# EAGLE design B135X (EAGLE 6.6.0)
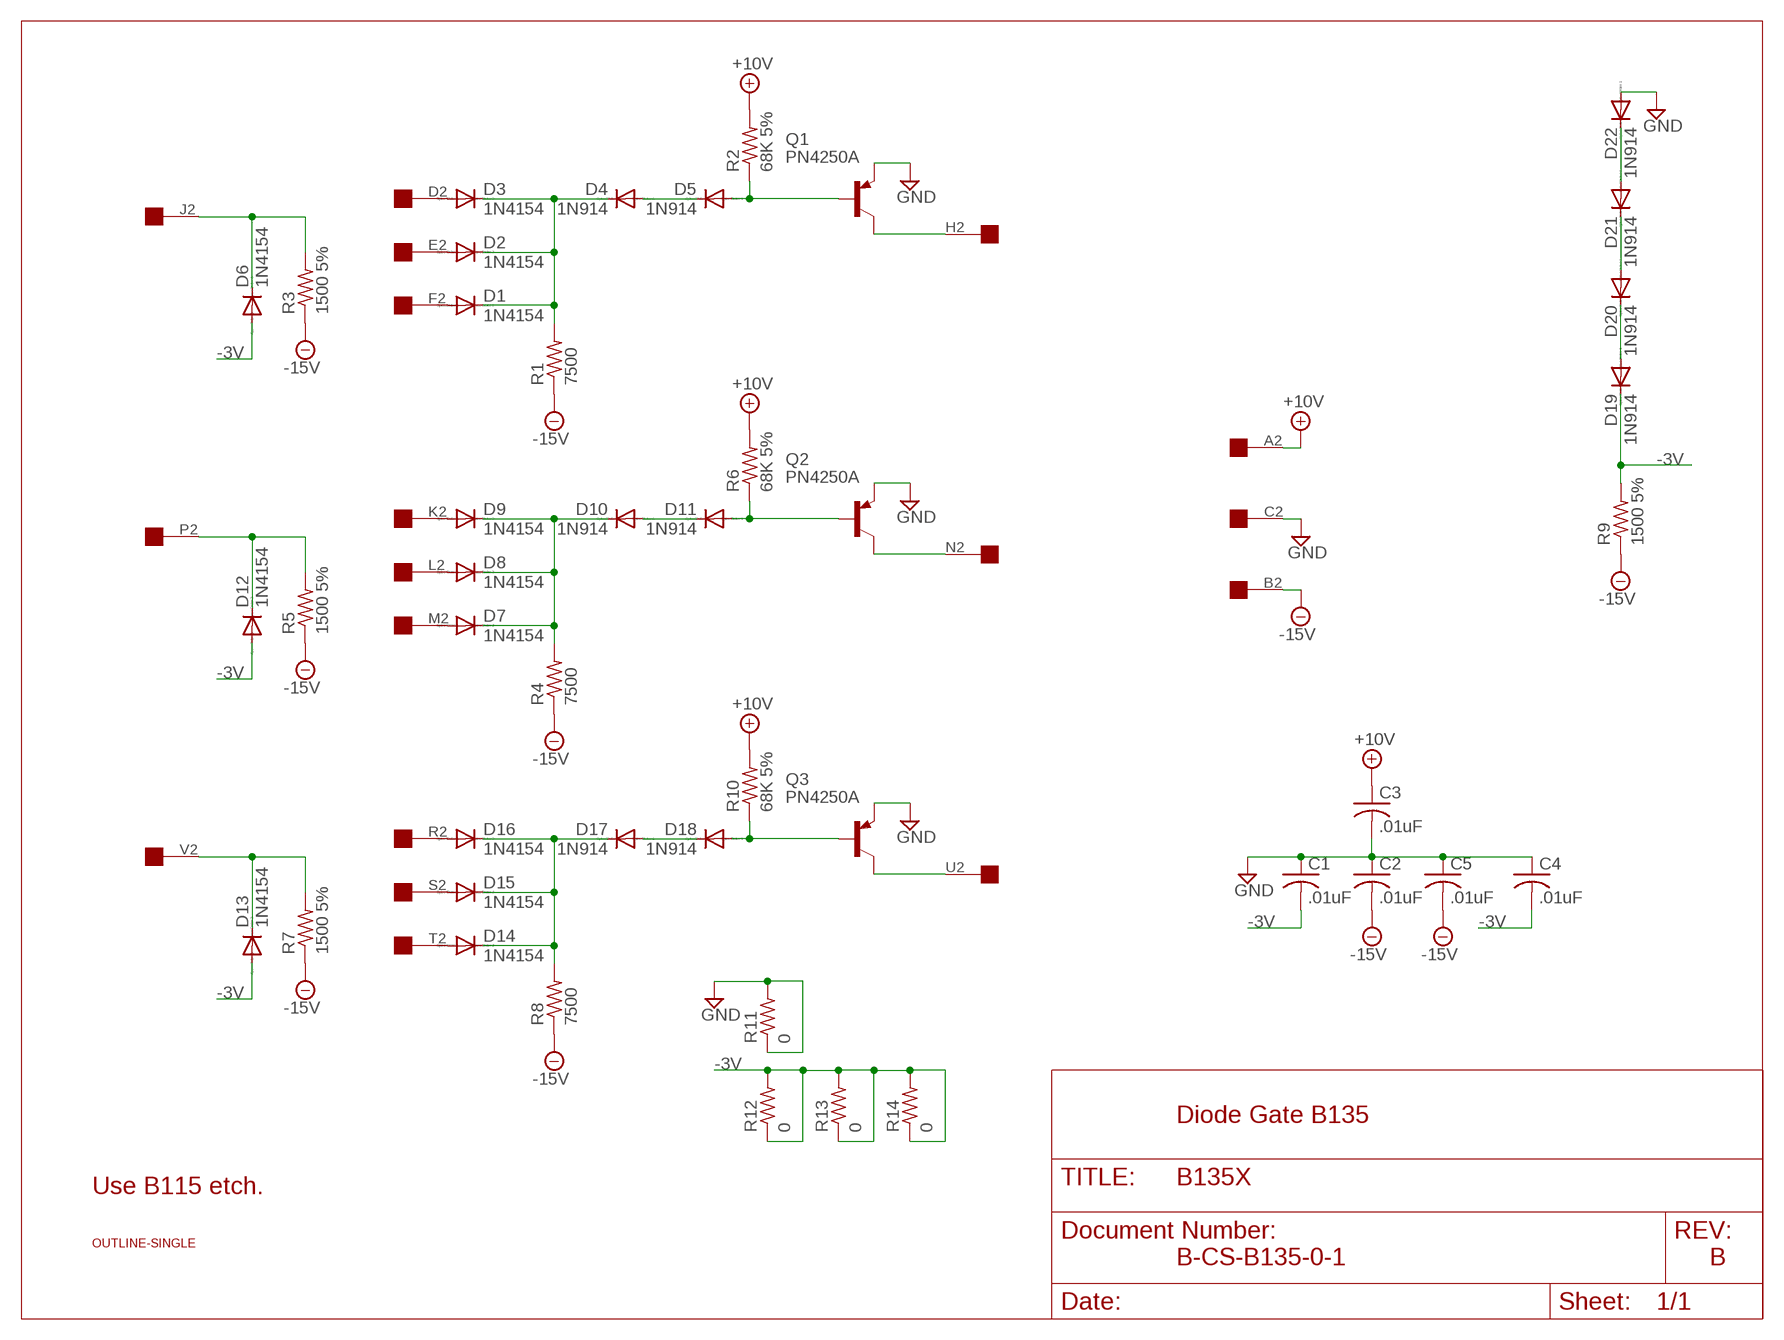
[diagram p0: schematic, sheet 1]

## Parts
C1  .01uF  C-US  [C063-025X075]
C2  .01uF  C-US  [C063-025X075]
C3  .01uF  C-US  [C063-025X075]
C4  .01uF  C-US  [C063-025X075]
C5  .01uF  C-US  [C063-025X075]
D1  1N4154  DIODE-DO35-10  [DO35-10]
D2  1N4154  DIODE-DO35-10  [DO35-10]
D3  1N4154  DIODE-DO35-10  [DO35-10]
D4  1N914  DIODE-DO35-10  [DO35-10]
D5  1N914  DIODE-DO35-10  [DO35-10]
D6  1N4154  DIODE-DO35-10  [DO35-10]
D7  1N4154  DIODE-DO35-10  [DO35-10]
D8  1N4154  DIODE-DO35-10  [DO35-10]
D9  1N4154  DIODE-DO35-10  [DO35-10]
D10  1N914  DIODE-DO35-10  [DO35-10]
D11  1N914  DIODE-DO35-10  [DO35-10]
D12  1N4154  DIODE-DO35-10  [DO35-10]
D13  1N4154  DIODE-DO35-10  [DO35-10]
D14  1N4154  DIODE-DO35-10  [DO35-10]
D15  1N4154  DIODE-DO35-10  [DO35-10]
D16  1N4154  DIODE-DO35-10  [DO35-10]
D17  1N914  DIODE-DO35-10  [DO35-10]
D18  1N914  DIODE-DO35-10  [DO35-10]
D19  1N914  DIODE-DO35-10  [DO35-10]
D20  1N914  DIODE-DO35-10  [DO35-10]
D21  1N914  DIODE-DO35-10  [DO35-10]
D22  1N914  DIODE-DO35-10  [DO35-10]
Q1  PN4250A  -PNP-TO5  [TO5]
Q2  PN4250A  -PNP-TO5  [TO5]
Q3  PN4250A  -PNP-TO5  [TO5]
R1  7500  R-US_0207/10  [0207/10]
R2  68K 5%  R-US_0207/10  [0207/10]
R3  1500 5%  R-US_0207/10  [0207/10]
R4  7500  R-US_0207/10  [0207/10]
R5  1500 5%  R-US_0207/10  [0207/10]
R6  68K 5%  R-US_0207/10  [0207/10]
R7  1500 5%  R-US_0207/10  [0207/10]
R8  7500  R-US_0207/10  [0207/10]
R9  1500 5%  R-US_0207/10  [0207/10]
R10  68K 5%  R-US_0207/10  [0207/10]
R11  0  R-US_0207/10  [0207/10]
R12  0  R-US_0207/10  [0207/10]
R13  0  R-US_0207/10  [0207/10]
R14  0  R-US_0207/10  [0207/10]
U$1  OUTLINE-SINGLE  [SINGLE]
U$2  EDGE-1  [EDGE-CON1]

## Nets
+10V: C3.1 R2.2 R6.2 R10.2 U$2.A2
-3V [Supply]: C1.2 C4.2 D6.A D12.A D13.A D19.C R9.2 R12.1 R12.2 R13.1 R13.2 R14.1 R14.2
-15V: C2.2 C5.2 R1.1 R3.1 R4.1 R5.1 R7.1 R8.1 R9.1 U$2.B2
GND [Supply]: C1.1 C2.1 C3.2 C4.1 C5.1 D22.A Q1.1(E) Q2.1(E) Q3.1(E) R11.1 R11.2 U$2.C2
N$1: D7.C D8.C D9.C D10.C R4.2
N$2: D1.A U$2.F2
N$3: D5.A Q1.2(B) R2.1
N$4: D2.A U$2.E2
N$5: D1.C D2.C D3.C D4.C R1.2
N$6: D9.A U$2.K2
N$7: D8.A U$2.L2
N$8: D7.A U$2.M2
N$9: D10.A D11.C
N$10: D3.A U$2.D2
N$11: Q1.3(C) U$2.H2
N$12: D11.A Q2.2(B) R6.1
N$13: Q2.3(C) U$2.N2
N$14: D14.C D15.C D16.C D17.C R8.2
N$15: D4.A D5.C
N$16: D16.A U$2.R2
N$17: D6.C R3.2 U$2.J2
N$18: D15.A U$2.S2
N$19: D14.A U$2.T2
N$20: D12.C R5.2 U$2.P2
N$21: D17.A D18.C
N$22: D18.A Q3.2(B) R10.1
N$23: Q3.3(C) U$2.U2
N$25: D13.C R7.2 U$2.V2
N$26: D21.A D22.C
N$27: D20.A D21.C
N$29: D19.A D20.C

## Notes on the sheet
- Diode Gate B135
- Use B115 etch.
- B-CS-B135-0-1 | B

## Library data of the parts
C1-C5 = dec-con:C-US: Capacitors with funky DEC lead spacing.
D1-D22 = diode:DIODE-: DIODE
Q1-Q3 = transistor:*-PNP-: PNP Transistror
R1-R14 = rcl:R-US_: RESISTOR, American symbol
U$1 = dec-con:OUTLINE-*: Board outlines for DEC boards.
U$2 = dec-con:EDGE-1: Single-Sided DEC Edge Connector -- (side 2)

## Net classes
0 default: width 0.813 mm
1 Supply: width 0.813 mm

## Board
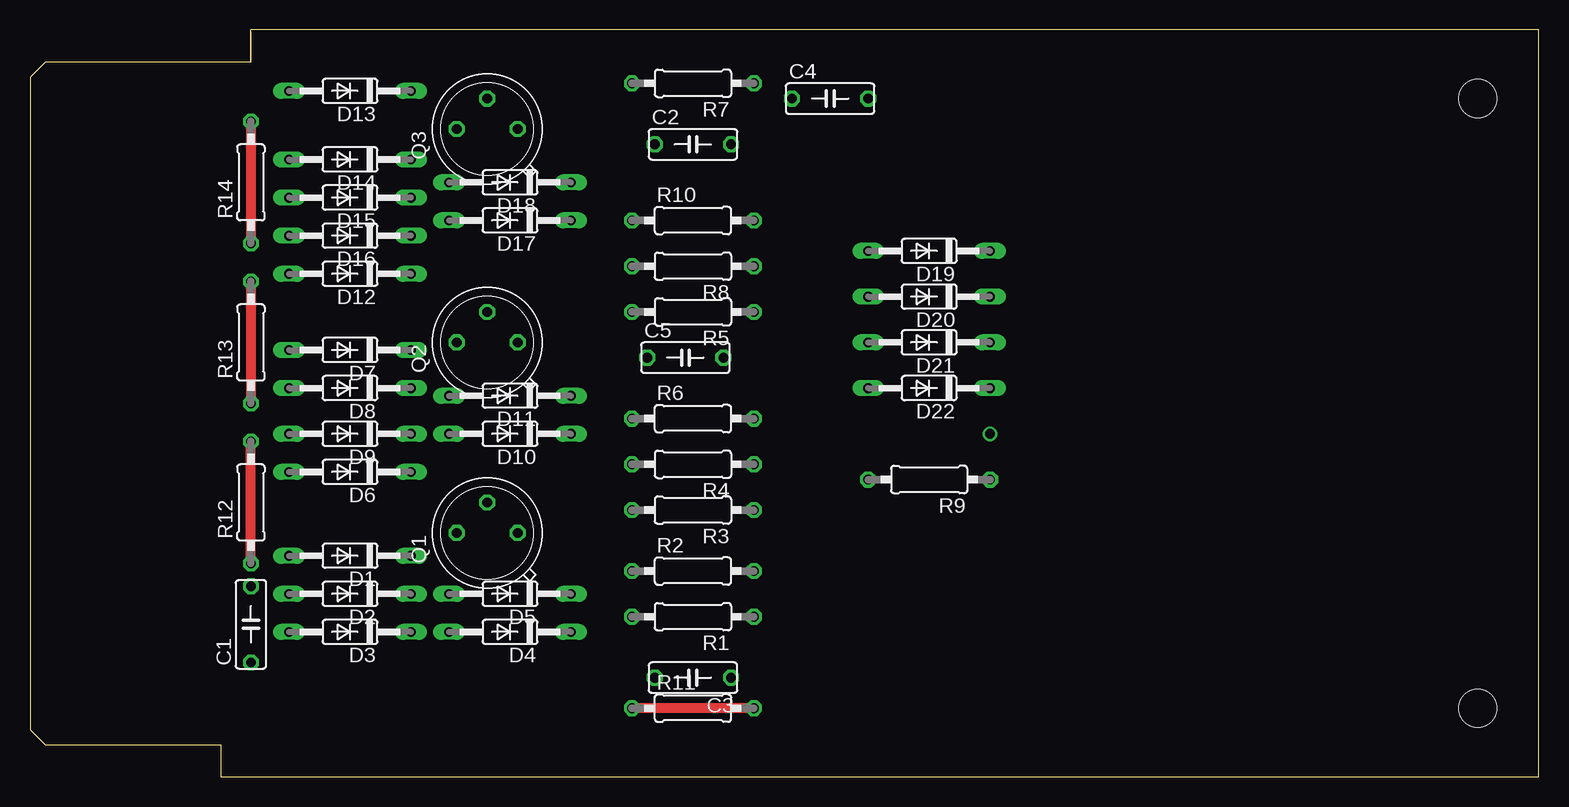
[diagram p1: board, top side]
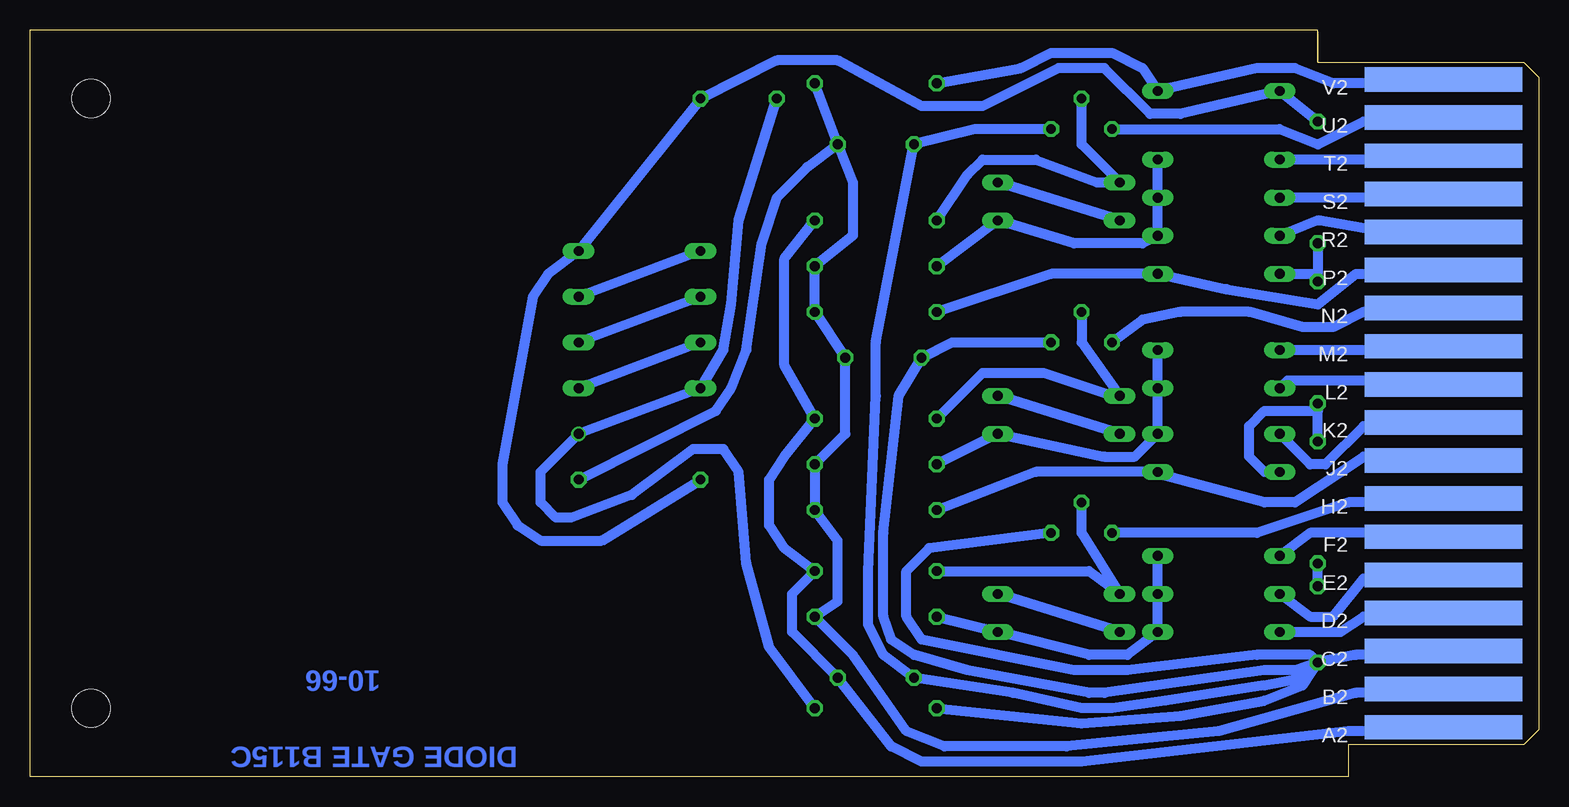
[diagram p2: board, bottom side, seen from below]

Size 125.73 x 62.23 mm. Coordinates in mm from the lower left corner, seen from the top.
Copper layers (1+16): Top 0.035mm / dielectric 1.5mm / Bottom 0.035mm
Design rules "16mils": minimum track width 16mil, minimum drill 32mil, track to track 15mil, track to pad 10mil, pad to pad 10mil, via to via 10mil, smd to smd 10mil, copper to edge 13mil, drill to drill 10mil, minimum pad ring 10mil, minimum via ring 8mil, stop-mask expansion 0mil, vias tented up to drill 0mil, thermal gap 10mil

### Footprints (pad centres in the part's own frame; a part is rotated, then mirrored left to right if it is on the bottom)
C063-025X075 = drill 0.813 octagon: 1 -2.54,0; 2 3.81,0
DO35-10 = drill 0.813 long: A 5.08,0; C -5.08,0
TO5 = drill 0.813 octagon: 1 0,-2.54; 2 2.54,0; 3 0,2.54
0207/10 = drill 0.813 octagon: 1 -5.08,0; 2 5.08,0
SINGLE = hole 3.175: 120.65,56.515; 120.65,5.715
EDGE-CON1 = smd 13.106 x 2.032 bottom: A2 7.938,4.128; B2 7.938,7.303; C2 7.938,10.477; D2 7.938,13.652; E2 7.938,16.828; F2 7.938,20.003; H2 7.938,23.177; J2 7.938,26.352; K2 7.938,29.527; L2 7.938,32.703; M2 7.938,35.877; N2 7.938,39.053; P2 7.938,42.227; R2 7.938,45.403; S2 7.938,48.578; T2 7.938,51.752; U2 7.938,54.928; V2 7.938,58.102

### Placement (x,y rotation side)
C1  18.42,12.06 90 top
C2  54.61,52.7 0 top
C3  55.88,8.26 180 top
C4  66.04,56.52 0 top
C5  53.98,34.92 0 top
D1  26.67,18.41 180 top
D2  26.67,15.24 180 top
D3  26.67,12.06 180 top
D4  40.01,12.06 180 top
D5  40.01,15.24 180 top
D6  26.67,25.4 180 top
D7  26.67,35.56 180 top
D8  26.67,32.38 180 top
D9  26.67,28.57 180 top
D10  40.01,28.57 180 top
D11  40.01,31.75 180 top
D12  26.67,41.91 180 top
D13  26.67,57.15 180 top
D14  26.67,51.44 180 top
D15  26.67,48.26 180 top
D16  26.67,45.09 180 top
D17  40.01,46.35 180 top
D18  40.01,49.53 180 top
D19  74.93,43.81 180 top
D20  74.93,40.01 180 top
D21  74.93,36.2 180 top
D22  74.93,32.38 180 top
Q1  38.1,20.32 90 top
Q2  38.1,36.2 90 top
Q3  38.1,53.98 90 top
R1  55.25,13.34 180 top
R2  55.25,17.14 0 top
R3  55.25,22.23 180 top
R4  55.25,26.04 180 top
R5  55.25,38.73 180 top
R6  55.25,29.84 0 top
R7  55.25,57.78 180 top
R8  55.25,42.55 180 top
R9  74.93,24.77 180 top
R10  55.25,46.35 0 top
R11  55.25,5.71 0 top
R12  18.42,22.86 90 top
R13  18.42,36.2 90 top
R14  18.42,49.53 90 top
U$1  0,0 0 top
U$2  0,0 0 top

### Tracks (layer width: path | path; a pad name or v marks a point on that pad's centre or on a via)
+10V
  Bottom 0.813: R10.2 62.87,43.18 62.87,34.29 R6.2 62.87,26.67 64.14,24.77 64.14,20.95 62.87,19.05 R2.2 62.23,15.24 62.23,12.06 C3.1 53.98,2.54 51.44,1.27 38.1,1.27 15.88,3.81 10.16,3.81 U$2.A2
-3V
  Top 0.813: R14.2 R14.1 | R13.2 R13.1 | R12.1 R12.2
  Bottom 0.813: R14.2 D13.A 29.85,55.24 32.39,55.24 36.2,59.05 40.01,59.05 46.36,55.88 51.44,55.88 58.42,59.69 63.5,59.69 C4.2 D19.C 82.55,41.91 83.82,40.01 86.36,26.04 86.36,22.86 85.09,20.95 83.19,19.68 78.11,19.68 R9.2 | C1.2 R12.1 | R12.2 18.42,30.48 | 18.42,30.48 R13.1 | D12.A 18.42,41.91 R13.2 R14.1 | D6.A 22.86,25.4 24.13,26.67 24.13,29.21 22.86,30.48 18.42,30.48
-15V
  Bottom 0.813: C2.2 57.15,49.53 57.15,45.09 R8.1 R5.1 C5.2 57.79,28.57 R4.1 R3.1 58.42,19.68 58.42,14.61 R1.1 57.15,10.16 52.71,3.81 49.53,2.54 39.37,2.54 26.67,3.81 15.24,6.99 9.53,6.99 U$2.B2 | C2.2 R7.1 | R9.1 68.58,30.48 67.31,32.38 66.04,35.56 64.77,44.45 63.5,48.26 60.96,50.8 C2.2
GND  (via drill 0.81)
  Top 0.813: R11.2 R11.1
  Bottom 0.813: U$2.C2 11.43,10.16 15.24,10.16 C1.1 | C1.1 19.05,10.16 23.5,10.16 34.29,8.89 38.74,8.89 51.44,11.43 52.71,13.34 52.71,17.14 50.8,19.05 Q1.1 | C1.1 20.32,8.89 22.86,8.89 36.2,6.99 37.47,6.99 47.63,8.89 52.07,10.16 53.98,11.43 54.61,13.34 54.61,20.32 53.34,31.75 C5.1 48.9,36.2 Q2.1 | R11.1 38.1,4.45 29.85,5.08 22.86,6.35 19.69,7.62 C1.1 | C1.1 19.69,8.26 22.86,7.62 31.12,6.35 35.56,5.71 38.1,5.71 43.82,6.99 C3.2 54.61,10.16 55.88,12.7 55.88,17.14 55.25,31.75 55.25,36.2 C2.1 46.99,53.98 Q3.1 | R11.2 64.14,10.79 66.04,17.78 66.68,25.4 67.95,27.3 70.49,27.3 75.57,23.5 80.65,21.59 81.92,21.59 83.19,22.86 83.19,25.4 v80.01,28.57 D22.A 67.95,35.56 67.31,39.37 66.68,46.35 C4.1
N$1
  Bottom 0.813: D7.C D8.C D9.C 33.66,26.67 36.2,26.67 D10.C R4.2
N$2
  Bottom 0.813: U$2.F2 8.26,20.32 19.05,20.32 D1.A
N$3
  Bottom 0.813: Q1.2 38.1,20.32 D5.A 37.47,17.14 R2.1
N$4
  Bottom 0.813: D2.A 19.05,13.34 17.15,13.34 14.61,16.51 8.26,16.51 U$2.E2
N$5
  Bottom 0.813: D1.C D2.C D3.C 34.29,10.16 37.47,10.16 D4.C R1.2
N$6
  Bottom 0.813: U$2.K2 8.89,29.21 14.61,29.21 17.78,26.04 19.05,26.04 D9.A
N$7
  Bottom 0.813: U$2.L2 8.89,33.02 20.96,33.02 D8.A
N$8
  Bottom 0.813: U$2.M2 8.89,35.56 D7.A
N$9
  Bottom 0.813: D10.A D11.C
N$10
  Bottom 0.813: D3.A 16.51,12.06 14.61,13.34 8.26,13.34 U$2.D2
N$11
  Bottom 0.813: U$2.H2 8.89,22.86 15.88,22.86 23.5,20.32 Q1.3
N$12
  Bottom 0.813: Q2.2 38.1,36.2 D11.A 35.56,31.75 41.28,33.66 46.36,33.66 R6.1
N$13
  Bottom 0.813: U$2.N2 8.89,38.73 14.61,38.73 17.15,37.47 19.69,37.47 24.13,38.73 29.85,38.73 33.02,38.1 Q2.3
N$14
  Bottom 0.813: R8.2 D17.C 38.74,44.45 33.02,44.45 D16.C D15.C D14.C
N$15
  Bottom 0.813: D4.A D5.C
N$16
  Bottom 0.813: U$2.R2 8.26,45.72 14.61,45.72 18.42,46.35 D16.A
N$17
  Bottom 0.813: D6.C 32.39,25.4 | 32.39,25.4 41.91,25.4 R3.2 | U$2.J2 8.89,26.67 14.61,26.67 20.32,22.86 22.86,22.86 32.39,25.4
N$18
  Bottom 0.813: U$2.S2 8.26,48.26 D15.A
N$19
  Bottom 0.813: U$2.T2 8.26,51.44 D14.A
N$20
  Bottom 0.813: R5.2 40.64,41.91 D12.C 26.04,40.64 18.42,39.37 15.24,41.91 8.26,41.91 U$2.P2
N$21
  Bottom 0.813: D17.A D18.C
N$22
  Bottom 0.813: Q3.2 38.1,52.7 D18.A 36.83,49.53 41.91,51.44 46.36,51.44 47.63,50.16 R10.1
N$23
  Bottom 0.813: Q3.3 21.59,53.98 18.42,52.7 14.61,54.61 8.26,54.61 U$2.U2
N$25
  Bottom 0.813: U$2.V2 8.26,57.78 17.15,57.78 20.32,59.05 23.5,59.05 D13.C 33.02,59.05 35.56,60.33 40.64,60.33 43.18,59.05 R7.2
N$26
  Bottom 0.813: D21.A D22.C
N$27
  Bottom 0.813: D20.A D21.C
N$29
  Bottom 0.813: D19.A D20.C

### Text on the board
Bottom: 10-66 | DIODE GATE B115C